# Altium schematic sheet PLL.SchDoc
size A4
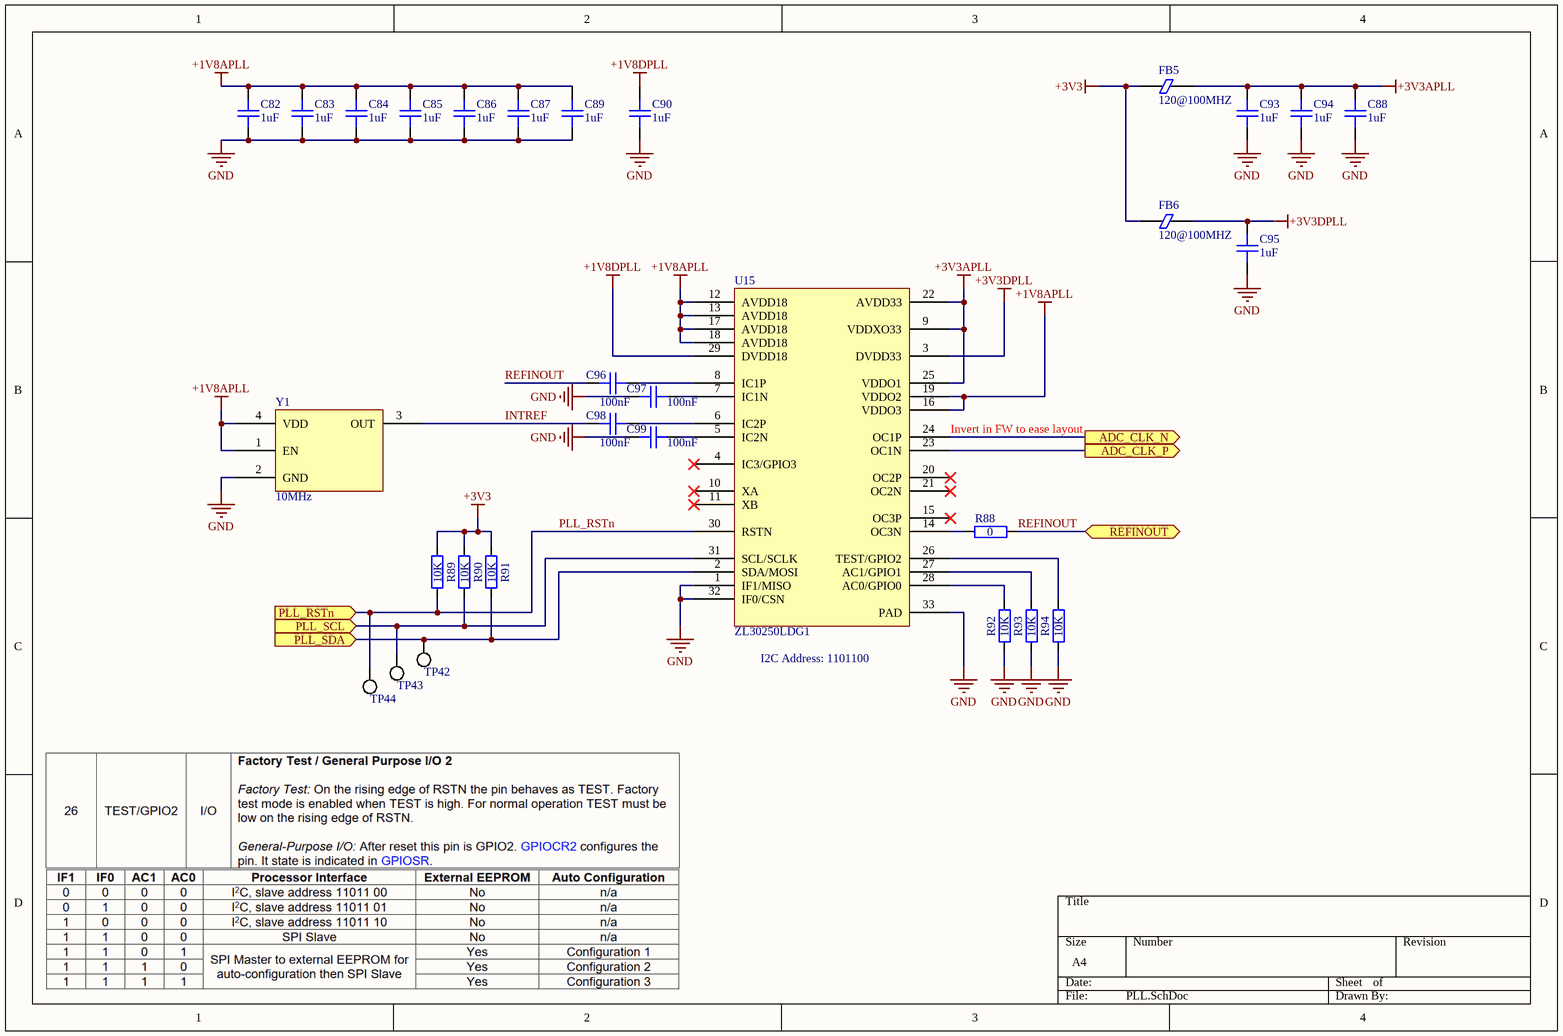
[diagram p0: PLL.SchDoc]

## Parts
C82  1uF  [GEN_C_0402]
C83  1uF  [GEN_C_0402]
C84  1uF  [GEN_C_0402]
C85  1uF  [GEN_C_0402]
C86  1uF  [GEN_C_0402]
C87  1uF  [GEN_C_0402]
C88  1uF  [GEN_C_0402]
C89  1uF  [GEN_C_0402]
C90  1uF  [GEN_C_0402]
C93  1uF  [GEN_C_0402]
C94  1uF  [GEN_C_0402]
C95  1uF  [GEN_C_0402]
C96  100nF  [GEN_C_0402]
C97  100nF  [GEN_C_0402]
C98  100nF  [GEN_C_0402]
C99  100nF  [GEN_C_0402]
FB5  120@100MHZ  [GEN_R_0402]
FB6  120@100MHZ  [GEN_R_0402]
R88  0  [GEN_R_0402]
R89  10K  [GEN_R_0402]
R90  10K  [GEN_R_0402]
R91  10K  [GEN_R_0402]
R92  10K  [GEN_R_0402]
R93  10K  [GEN_R_0402]
R94  10K  [GEN_R_0402]
TP42  PCB  [GEN_TP_PCB]  (value not drawn)  (no BOM)
TP43  PCB  [GEN_TP_PCB]  (value not drawn)  (no BOM)
TP44  PCB  [GEN_TP_PCB]  (value not drawn)  (no BOM)
U15  ZL30250LDG1  [MC_QFN32_ZL30250]
Y1  10MHz  [ECS_TXO-3225]

## Ports
ADC_CLK_N (out), ADC_CLK_P (out), PLL_RSTn (in), PLL_SCL (in), PLL_SDA (in), REFINOUT (bidir)

## Nets
+1V8APLL: C82.1 C83.1 C84.1 C85.1 C86.1 C87.1 C89.1 U15.12(AVDD18) U15.13(AVDD18) U15.16(VDDO3) U15.17(AVDD18) U15.18(AVDD18) U15.19(VDDO2) Y1.1(EN) Y1.4(VDD)
+1V8DPLL: C90.1 U15.29(DVDD18)
+3V3: FB5.1 FB6.1 R89.2 R90.2 R91.2
+3V3APLL: C88.1 C93.1 C94.1 FB5.2 U15.9(VDDXO33) U15.22(AVDD33) U15.25(VDDO1)
+3V3DPLL: C95.1 FB6.2 U15.3(DVDD33)
GND: C82.2 C83.2 C84.2 C85.2 C86.2 C87.2 C88.2 C89.2 C90.2 C93.2 C94.2 C95.2 C97.2 C99.2 R92.1 R93.1 R94.1 U15.1(IF1/MISO) U15.32(IF0/CSN) U15.33(PAD) Y1.2(GND)
ADC_CLK_N: U15.24(OC1P) ; port ADC_CLK_N
ADC_CLK_P: U15.23(OC1N) ; port ADC_CLK_P
INTREF: C98.2 Y1.3(OUT)
PLL_RSTn: R89.1 TP44.1 U15.30(RSTN) ; port PLL_RSTn
PLL_SCL: R90.1 TP43.1 U15.31(SCL/SCLK) ; port PLL_SCL
PLL_SDA: R91.1 TP42.1 U15.2(SDA/MOSI) ; port PLL_SDA
REFINOUT: C96.2 R88.2 ; port REFINOUT
NetC96_1: C96.1 U15.8(IC1P)
NetC97_1: C97.1 U15.7(IC1N)
NetC98_1: C98.1 U15.6(IC2P)
NetC99_1: C99.1 U15.5(IC2N)
NetR88_1: R88.1 U15.14(OC3N)
NetR92_2: R92.2 U15.28(AC0/GPIO0)
NetR93_2: R93.2 U15.27(AC1/GPIO1)
NetR94_2: R94.2 U15.26(TEST/GPIO2)

Not connected (* = marked no-connect by the designer): U15 4(IC3/GPIO3)* 10(XA)* 11(XB)* 15(OC3P)* 20(OC2P)* 21(OC2N)*

## Notes on the sheet
- (near U15) Invert in FW to ease layout
- (near U15) I2C Address: 1101100

## Library data of the parts
C82-C90 C93-C95 = CAP 1uF 25V X5R 0402: Voltage Rating: 25V; Package: 0402; Supplier 1: Digi-Key; Supplier Part Number 1: 490-10017-1-ND; Value: 1uF
C96-C99 = CAP 100nF 16V X7R 0402: Voltage Rating: 16V; Package: 0402; Supplier 1: Digi-Key; Supplier Part Number 1: 490-4759-1-ND; Value: 100nF
FB5 FB6 = FERRITE BEAD 120 OHM 0402: Supplier 1: Digi-Key; Supplier Part Number 1: 490-9656-1-ND
R88 = RES 0 OHM 1/16W 0402: Power Rating: 0.0625W; Package: 0402; Supplier 1: Digi-Key; Supplier Part Number 1: 311-0.0JRCT-ND; Value: 0
R89-R94 = RES 10K OHM 1% 1/10W 0402: Tolerance: 1%; Power Rating: 0.1W; Package: 0402; Supplier 1: Digi-Key; Supplier Part Number 1: P10.0KLCT-ND; Value: 10K
TP42-TP44 = TP PCB 1mm
U15 = IC CLK GEN ZL30250LDG1: Supplier 1: Mouser; Supplier Part Number 1: 494-ZL30250LDG1
Y1 = OSC 10MHz ECS-TXO-3225MV: Supplier 1: Digi-Key; Supplier Part Number 1: 50-ECS-TXO-3225MV-100-CT-ND